# EAGLE schematic M3SAnalyzerSniffer (EAGLE 6.1)
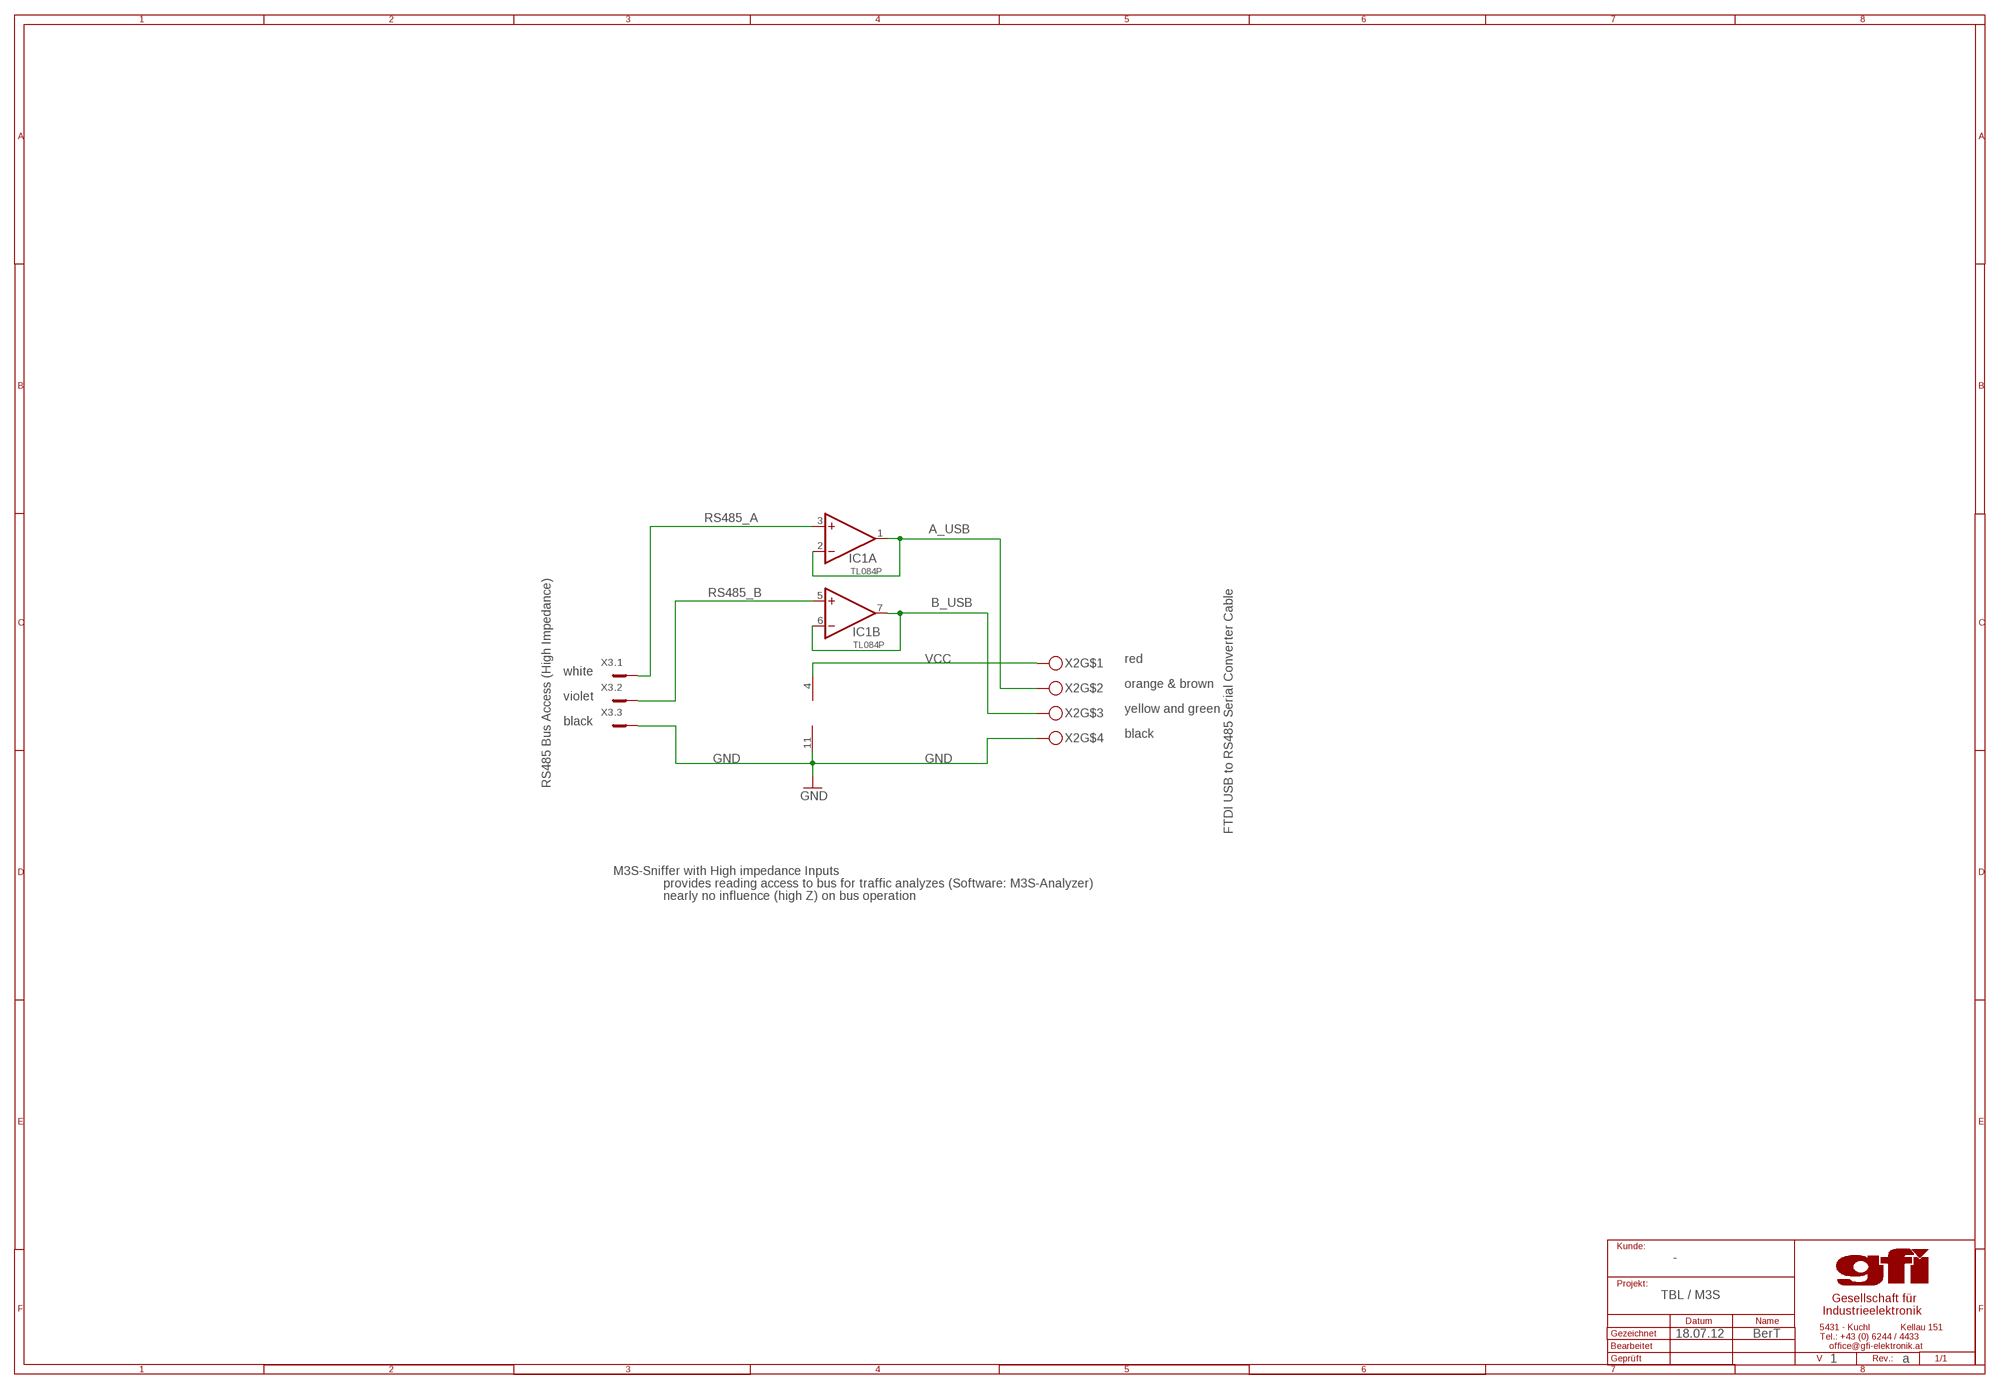
[diagram p0: schematic, sheet 1]

## Parts
IC1  TL084P  [DIL14]
X2  MCB1,5-2-G-3,81  [1803442]
X3  MC3  [MC3]

## Nets
A_USB: IC1.1(A:OUT) IC1.2(A:-IN) X2.2
B_USB: IC1.6(B:-IN) IC1.7(B:OUT) X2.3
GND: IC1.11(P:V-) X2.4 X3.3
RS485_A: IC1.3(A:+IN) X3.1
RS485_B: IC1.5(B:+IN) X3.2
VCC: IC1.4(P:V+) X2.1
Unconnected: IC1.8(C:OUT) IC1.9(C:-IN) IC1.10(C:+IN) IC1.12(D:+IN) IC1.13(D:-IN) IC1.14(D:OUT)

## Notes on the sheet
- FTDI USB to RS485 Serial Converter Cable
- red
- white
- orange & brown
- violet
- yellow and green
- black
- black
- RS485 Bus Access (High Impedance)
- M3S-Sniffer with High impedance Inputs
- provides reading access to bus for traffic analyzes (Software: M3S-Analyzer)
- nearly no influence (high Z) on bus operation
- -
- TBL / M3S
- 18.07.12 | BerT
- 1 | a

## Library data of the parts
IC1 = linear:TL084: OP AMP
X2 = !GFI_Connectors:MCB1,5-2-G-3,81
X3 = con-phoenix-381_l:MC3: Mini-Combicon 3.81mm horizontal 3-polig MC 1,5/3-G-3,81 Artikel-Nr. 1803280